# EAGLE design motor_control (EAGLE 9.6.2)
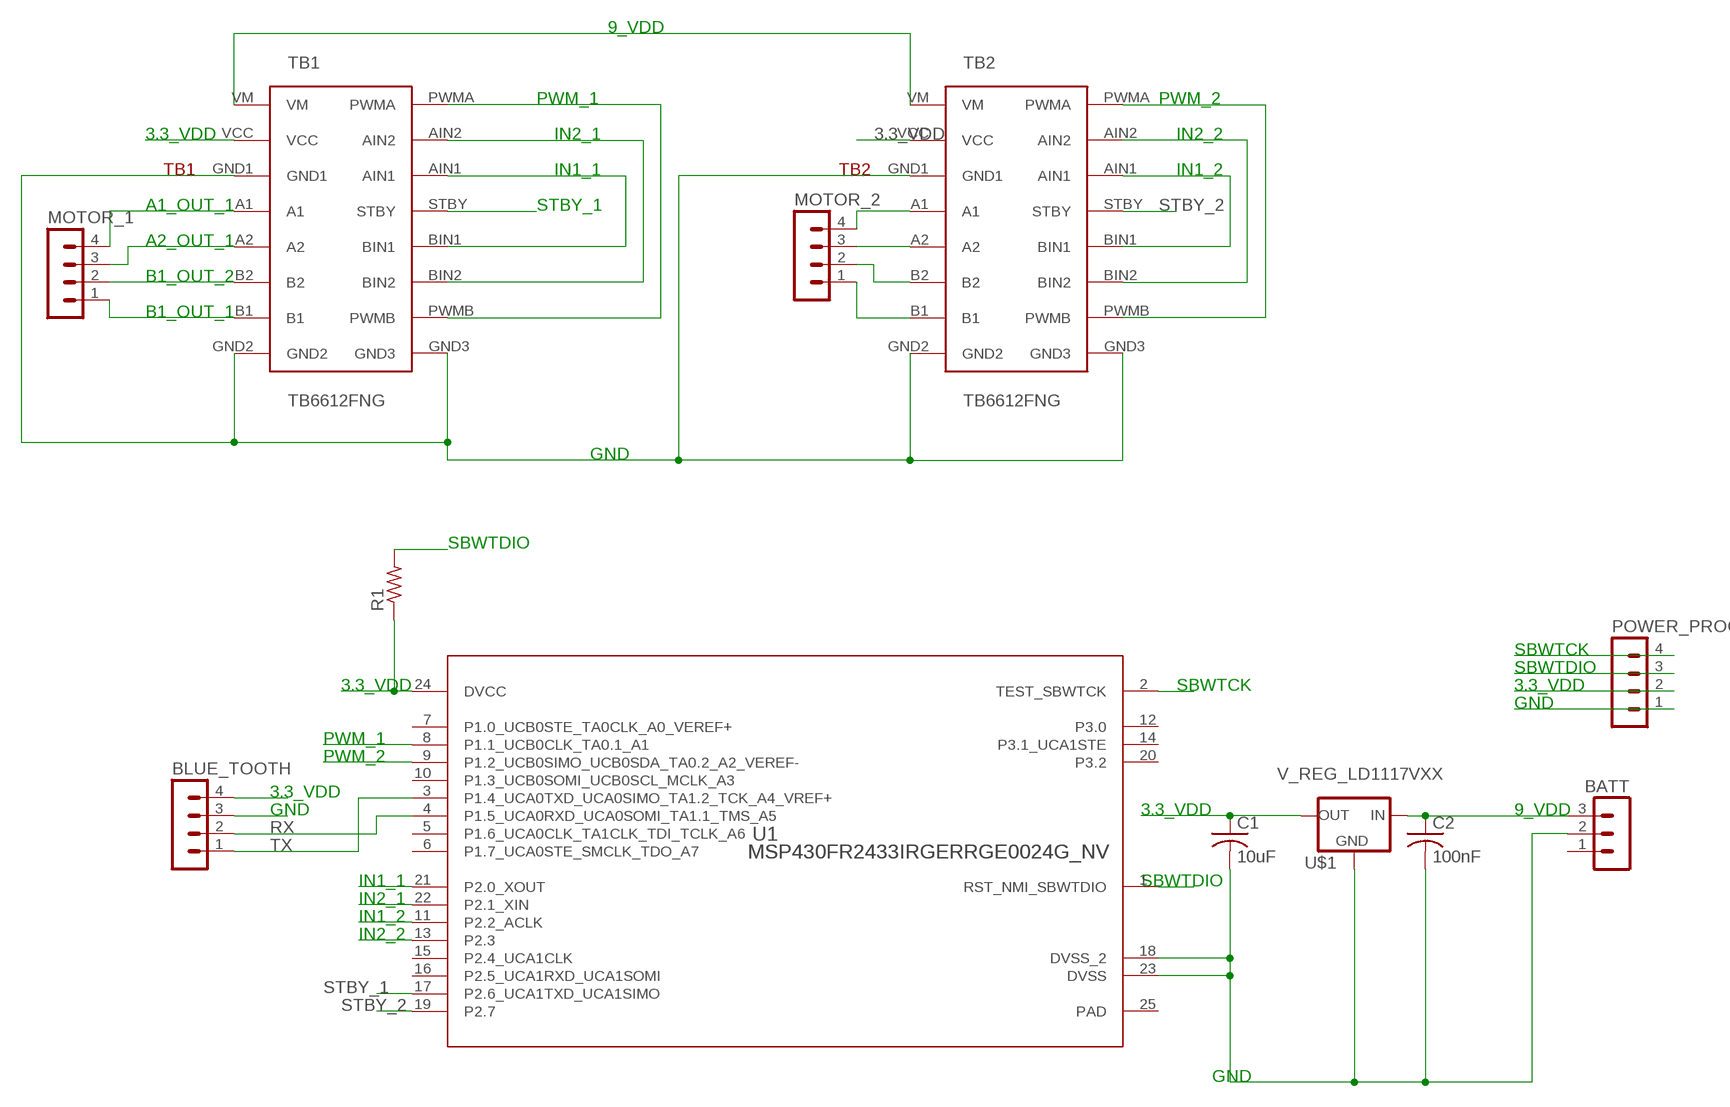
[diagram p0: schematic, sheet 1]

## Parts
BATT  MA03-1  [MA03-1]
BLUE_TOOTH  MA04-1  [MA04-1]
C1  10uF  C-USC1206  [C1206]
C2  100nF  C-USC1206  [C1206]
MOTOR_1  MA04-1  [MA04-1]
MOTOR_2  MA04-1  [MA04-1]
POWER_PROG  MA04-1  [MA04-1]
R1  R-US_R1206  [R1206]
TB1  TB6612FNG  [TB6612FNG]
TB2  TB6612FNG  [TB6612FNG]
U1  MSP430FR2433IRGERRGE0024G_NV  [RGE0024G_NV]
U$1  V_REG_LD1117VXX  [78XXL]

## Nets
3.3_VDD: BLUE_TOOTH.4 C1.1 POWER_PROG.2 R1.1 TB1.VCC TB2.VCC U1.24(DVCC) U$1.GND(OUT)
9_VDD: BATT.3 C2.1 TB1.VM TB2.VM U$1.OUT(IN)
A1_OUT_1: MOTOR_1.4 TB1.A1
A2_OUT_1: MOTOR_1.3 TB1.A2
B1_OUT_1: MOTOR_1.1 TB1.B1
B1_OUT_2: MOTOR_1.2 TB1.B2
GND: BATT.2 BLUE_TOOTH.3 C1.2 C2.2 POWER_PROG.1 TB1.GND1 TB1.GND2 TB1.GND3 TB2.GND1 TB2.GND2 TB2.GND3 U1.18(DVSS_2) U1.23(DVSS) U$1.IN(GND)
IN1_1: TB1.AIN1 TB1.BIN1 U1.21(P2.0_XOUT)
IN1_2: TB2.AIN1 TB2.BIN1 U1.11(P2.2_ACLK)
IN2_1: TB1.AIN2 TB1.BIN2 U1.22(P2.1_XIN)
IN2_2: TB2.AIN2 TB2.BIN2 U1.13(P2.3)
N$3: MOTOR_2.4 TB2.A1
N$4: MOTOR_2.3 TB2.A2
N$5: MOTOR_2.2 TB2.B2
N$6: MOTOR_2.1 TB2.B1
PWM_1: TB1.PWMA TB1.PWMB U1.8(P1.1_UCB0CLK_TA0.1_A1)
PWM_2: TB2.PWMA TB2.PWMB U1.9(P1.2_UCB0SIMO_UCB0SDA_TA0.2_A2_VEREF-)
RX: BLUE_TOOTH.2 U1.4(P1.5_UCA0RXD_UCA0SOMI_TA1.1_TMS_A5)
SBWTCK: POWER_PROG.4 U1.2(TEST_SBWTCK)
SBWTDIO: POWER_PROG.3 R1.2 U1.1(RST_NMI_SBWTDIO)
STBY_1: TB1.STBY U1.17(P2.6_UCA1TXD_UCA1SIMO)
STBY_2: TB2.STBY U1.19(P2.7)
TX: BLUE_TOOTH.1 U1.3(P1.4_UCA0TXD_UCA0SIMO_TA1.2_TCK_A4_VREF+)
Unconnected: BATT.1 U1.5(P1.6_UCA0CLK_TA1CLK_TDI_TCLK_A6) U1.6(P1.7_UCA0STE_SMCLK_TDO_A7) U1.7(P1.0_UCB0STE_TA0CLK_A0_VEREF+) U1.10(P1.3_UCB0SOMI_UCB0SCL_MCLK_A3) U1.12(P3.0) U1.14(P3.1_UCA1STE) U1.15(P2.4_UCA1CLK) U1.16(P2.5_UCA1RXD_UCA1SOMI) U1.20(P3.2)

## Power pins joined to a net without a drawn wire
PAD: U1.25(PAD)

## Library data of the parts
BATT = con-lstb:MA03-1: PIN HEADER; OC_FARNELL: unknown; OC_NEWARK: unknown
BLUE_TOOTH MOTOR_1 MOTOR_2 POWER_PROG = con-lstb:MA04-1: PIN HEADER; OC_FARNELL: unknown; OC_NEWARK: unknown
C1 C2 = rcl:C-US: CAPACITOR, American symbol; SPICEPREFIX: C
R1 = rcl:R-US_: RESISTOR, American symbol; SPICEPREFIX: R
TB1 TB2 = TB6612FNG:TB6612FNG
U1 = Texas Instruments - MSP430FR2433IRGET:MSP430FR2433IRGER; COPYRIGHT: Copyright (C) 2023 Ultra Librarian. All rights reserved.; MANUFACTURER_PART_NUMBER: MSP430FR2433IRGER; MFR_NAME: Texas Instruments; REFDES: RefDes; TYPE: TYPE
U$1 = 1X08_OFFSET_75_PERCENT:V_REG_LD1117VXX: LD1117VXX voltage regulator. We carry the 3.3V version (COM-00526) in TO-220 package.

## Board
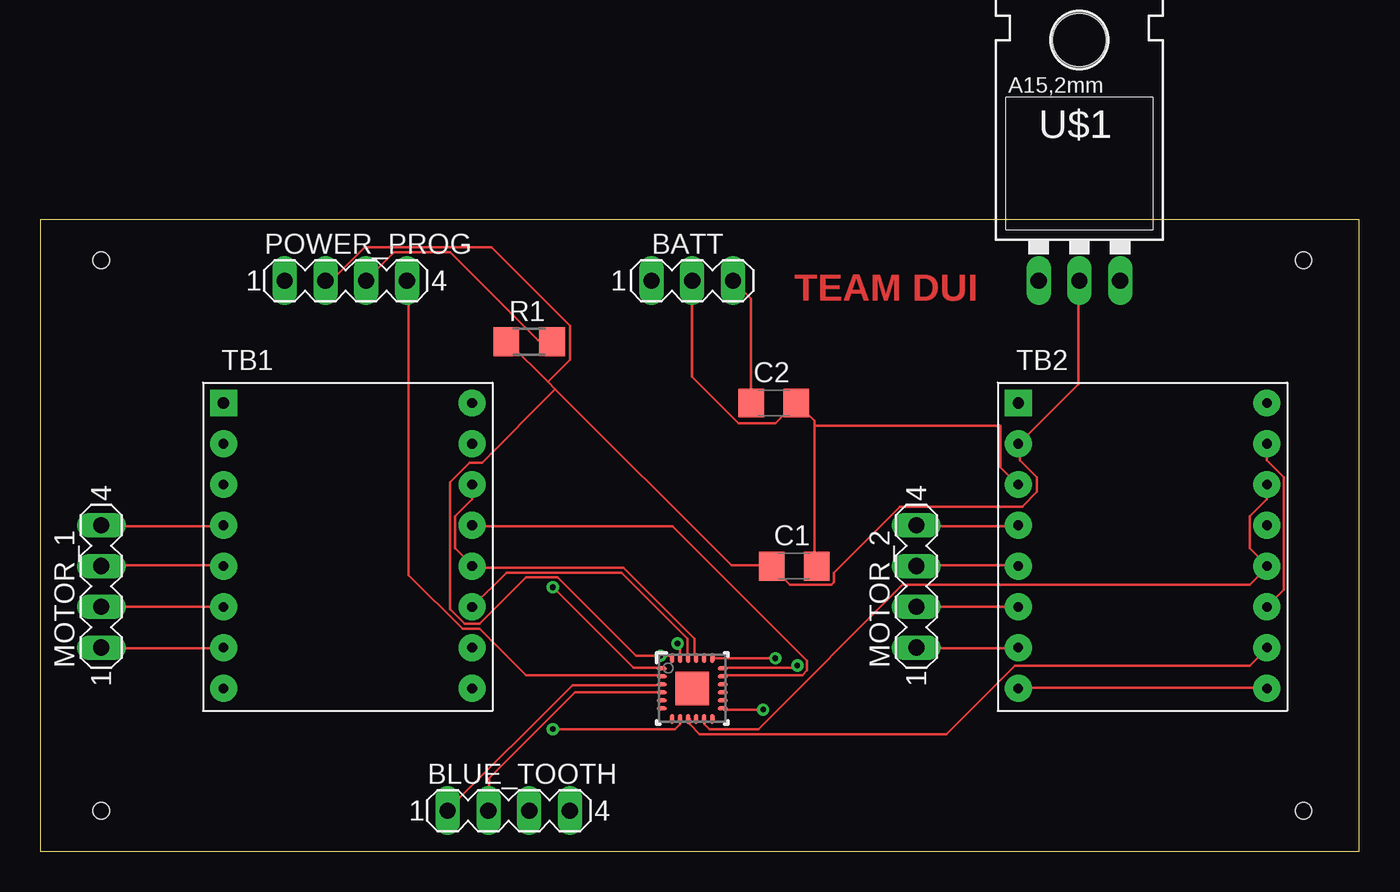
[diagram p1: board, top side]
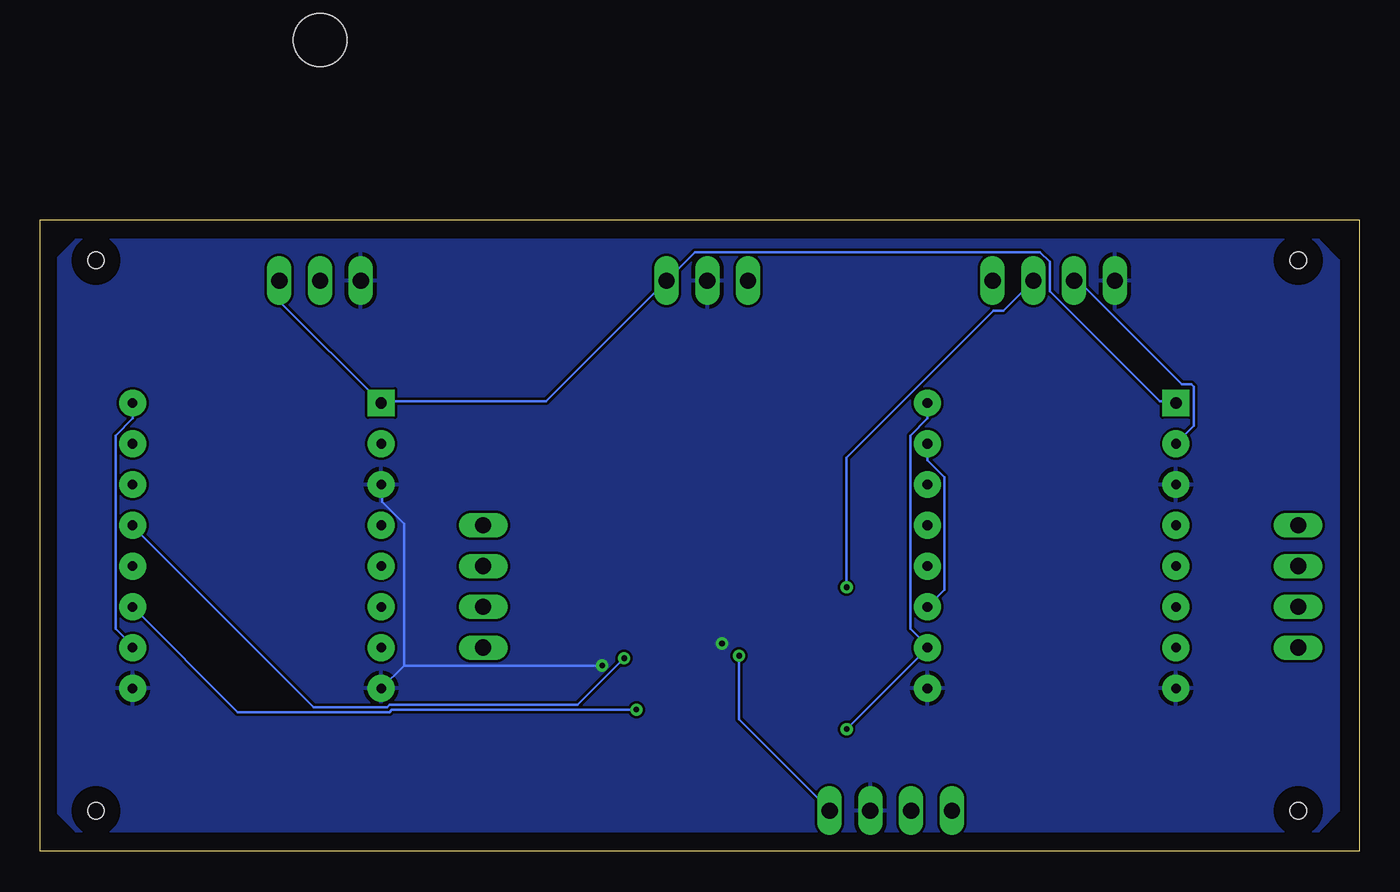
[diagram p2: board, bottom side, seen from below]

Size 82.22 x 39.36 mm. Coordinates in mm from the lower left corner, seen from the top.
Outline: 0,0 82.22,0 82.22,39.36 0,39.36 0,0
Copper layers (1*16): Top 0.035mm / dielectric 1.5mm / Bottom 0.035mm
Design rules "default": minimum track width 6mil, minimum drill 0.35mm, track to track 6mil, track to pad 6mil, pad to pad 6mil, via to via 6mil, smd to smd 6mil, copper to edge 40mil, drill to drill 6mil, minimum pad ring 10mil, minimum via ring 8mil, stop-mask expansion 4mil, vias tented up to drill 0mil, thermal gap 10mil
Holes 1 mm at 3.81,36.83 78.74,2.54 78.74,36.83 3.81,2.54

### Footprints (pad centres in the part's own frame; a part is rotated, then mirrored left to right if it is on the bottom)
MA03-1 = drill 1.016 long: 1 -2.54,0; 2 0,0; 3 2.54,0
MA04-1 = drill 1.016 long: 1 -3.81,0; 2 -1.27,0; 3 1.27,0; 4 3.81,0
C1206 = smd 1.6 x 1.8: 1 -1.4,0; 2 1.4,0
R1206 = smd 1.6 x 1.803: 1 -1.422,0; 2 1.422,0
TB6612FNG = drill 0.6 pad 1.676: A1 -7.62,-1.27; A2 -7.62,-3.81; AIN1 7.874,1.27; AIN2 7.874,3.81; B1 -7.62,-8.89; B2 -7.62,-6.35; BIN1 7.874,-3.81; BIN2 7.874,-6.35; GND1 -7.62,1.27; GND2 -7.62,-11.43; GND3 7.874,-11.43; PWMA 7.874,6.35; PWMB 7.874,-8.89; STBY 7.874,-1.27; VCC -7.62,3.81 | drill 0.7 pad 1.676 square: VM -7.62,6.35
RGE0024G_NV = smd 0.6 x 0.24: 1 -1.9,1.25; 2 -1.9,0.75; 3 -1.9,0.25; 4 -1.9,-0.25; 5 -1.9,-0.75; 6 -1.9,-1.25; 13 1.9,-1.25; 14 1.9,-0.75; 15 1.9,-0.25; 16 1.9,0.25; 17 1.9,0.75; 18 1.9,1.25 | smd 0.24 x 0.6: 7 -1.25,-1.9; 8 -0.75,-1.9; 9 -0.25,-1.9; 10 0.25,-1.9; 11 0.75,-1.9; 12 1.25,-1.9; 19 1.25,1.9; 20 0.75,1.9; 21 0.25,1.9; 22 -0.25,1.9; 23 -0.75,1.9; 24 -1.25,1.9 | smd 2.1 x 2.1: 25 0,0
78XXL = drill 1.016 long: GND 0,-3.81; IN -2.54,-3.81; OUT 2.54,-3.81 | hole 3.302: 0,11.176

### Placement (x,y rotation side)
BATT  40.64,35.56 0 top
BLUE_TOOTH  29.21,2.54 0 top
C1  46.99,17.78 0 top
C2  45.72,27.94 0 top
MOTOR_1  3.81,16.51 90 top
MOTOR_2  54.61,16.51 90 top
POWER_PROG  19.05,35.56 0 top
R1  30.48,31.75 0 top
TB1  19.05,21.59 0 top
TB2  68.58,21.59 0 top
U1  40.64,10.16 0 top
U$1  64.77,39.37 0 top

### Tracks (layer width: path | path; a pad name or v marks a point on that pad's centre or on a via)
3.3_VDD  (via drill 0.35)
  Top 0.152: U$1.GND 64.72,35.51 64.72,29.11 61.06,25.45 TB2.VCC 61.06,25.3 61.06,24.38 62.13,23.32 62.13,22.4 61.21,21.49 53.59,21.49 49.48,17.37 49.48,16.76 49.33,16.61 46.74,16.61 45.67,17.68 C1.1 45.52,17.83 43.08,17.83 32.11,28.8 | U1.24 39.42,12.19 v38.66,12.19 37.14,12.19 32.26,17.07 30.28,17.07 27.38,14.17 26.47,14.17 25.55,15.09 25.55,23.01 26.77,24.23 27.53,24.23 32.11,28.8 | 31.65,29.26 29.21,31.7 R1.1 | 31.65,29.26 32.11,28.8 | 31.65,29.26 33.02,30.63 33.02,32.77 28.14,37.64 20.22,37.64 18.24,35.66 17.78,35.66 POWER_PROG.2
  Bottom 0.152: TB1.VCC 10.31,26.52 10.31,28.96 10.46,29.11 11.07,29.11 17.48,35.51 17.78,35.51 POWER_PROG.2 | v38.66,12.19 38.66,8.23 33.02,2.59 BLUE_TOOTH.4
9_VDD
  Top 0.152: BATT.3 44.3,34.44 44.3,28.04 C2.1
  Bottom 0.152: U$1.OUT 67.31,34.29 TB2.VM 60.91,28.04 50.7,28.04 BATT.3 41.4,37.34 19.91,37.34 19.3,36.73 19.3,34.9 12.45,28.04 11.53,28.04 TB1.VM
A1_OUT_1
  Top 0.152: MOTOR_1.4 3.91,20.27 11.38,20.27 TB1.A1
A2_OUT_1
  Top 0.152: MOTOR_1.3 3.91,17.83 11.38,17.83 TB1.A2
B1_OUT_1
  Top 0.152: MOTOR_1.1 3.91,12.65 11.38,12.65 TB1.B1
B1_OUT_2
  Top 0.152: TB1.B2 MOTOR_1.2
GND  (via drill 0.35)
  Top 0.152: 62.13,35.51 U$1.IN | TB2.GND1 60.91,22.86 59.84,23.93 59.84,26.52 48.26,26.52 | 48.26,26.52 48.26,26.82 47.19,27.89 C2.2 47.04,27.89 45.82,26.67 43.54,26.67 40.64,29.57 BATT.2 | 48.26,26.52 48.26,17.83 C1.2 | 11.53,10.21 TB1.GND2 | 11.53,22.86 TB1.GND1 | v47.19,11.58 47.04,11.43 42.62,11.43 U1.18 | v39.73,12.95 39.88,12.8 39.88,12.19 U1.23 | TB2.GND3 76.45,10.21 61.06,10.21 TB2.GND2
  Bottom 0.152: 26.92,10.06 TB1.GND3 | 59.54,11.58 v47.19,11.58 | TB2.GND2 59.54,11.58 | 11.53,10.21 TB1.GND2 | 59.54,11.58 59.54,20.42 60.91,21.79 60.91,22.86 TB2.GND1
  pour Bottom: 8.89,38.1 2.54,38.1 1.27,36.83 1.27,2.54 2.54,1.27 80.01,1.27 81.28,2.54 81.28,36.83 80.01,38.1
IN1_1
  Top 0.152: U1.21 40.79,12.19 40.79,13.26 36.37,17.68 26.92,17.68 TB1.BIN1 26.92,17.83 25.86,18.9 25.86,20.88 26.92,21.95 TB1.AIN1
IN1_2
  Top 0.152: U1.11 41.4,8.23 41.4,7.92 41.71,7.62 44.75,7.62 53.75,16.61 75.39,16.61 76.45,17.68 TB2.BIN1 76.45,17.83 75.39,18.9 75.39,20.88 76.45,21.95 TB2.AIN1
IN2_1
  Top 0.152: TB1.BIN2 29.06,17.37 36.22,17.37 40.33,13.26 40.33,12.19 U1.22
  Bottom 0.152: TB1.AIN2 26.92,24.38 25.86,23.32 25.86,16.31 TB1.BIN2
IN2_2  (via drill 0.35)
  Top 0.152: v45.06,8.84 42.62,8.84 U1.13 | TB2.AIN2 76.45,24.38 77.52,23.32 77.52,16.31 TB2.BIN2
  Bottom 0.152: v45.06,8.84 60.3,8.84 60.45,8.69 69.9,8.69 TB2.BIN2
N$3
  Top 0.152: MOTOR_2.4 54.66,20.27 60.91,20.27 TB2.A1
N$4
  Top 0.152: MOTOR_2.3 54.66,17.83 60.91,17.83 TB2.A2
N$5
  Top 0.152: TB2.B2 MOTOR_2.2
N$6
  Top 0.152: MOTOR_2.1 54.66,12.65 60.91,12.65 TB2.B1
PWM_1  (via drill 0.35)
  Top 0.152: v31.95,7.62 39.57,7.62 39.88,7.92 39.88,8.23 U1.8
  Bottom 0.152: v31.95,7.62 26.92,12.65 TB1.PWMB 26.92,12.8 27.99,13.87 27.99,25.91 26.92,26.98 TB1.PWMA
PWM_2
  Top 0.152: U1.9 40.49,8.23 40.49,7.92 41.1,7.31 56.49,7.31 60.76,11.58 75.39,11.58 76.45,12.65 TB2.PWMB
  Bottom 0.152: TB2.PWMA 76.45,26.98 77.52,25.91 77.52,13.87 76.45,12.8 TB2.PWMB
RX
  Top 0.152: U1.4 38.66,9.91 33.33,9.91 27.99,4.57 27.99,2.59 BLUE_TOOTH.2
SBWTCK
  Top 0.152: U1.2 38.66,10.97 30.28,10.97 27.38,13.87 26.31,13.87 22.96,17.22 22.96,35.51 POWER_PROG.4
SBWTDIO  (via drill 0.35)
  Top 0.152: v31.95,16.46 36.98,11.43 38.66,11.43 U1.1 | R1.2 31.8,31.85 31.04,31.85 25.55,37.34 22.05,37.34 20.37,35.66 POWER_PROG.3
  Bottom 0.152: v31.95,16.46 31.95,24.54 22.81,33.68 22.2,33.68 POWER_PROG.3
STBY_1
  Top 0.152: U1.17 42.62,10.97 47.5,10.97 47.8,11.28 47.8,11.89 39.42,20.27 26.92,20.27 TB1.STBY
STBY_2  (via drill 0.35)
  Top 0.152: v45.82,12.04 41.86,12.04 U1.19
  Bottom 0.152: v45.82,12.04 48.72,9.14 60.45,9.14 60.6,8.99 65.18,8.99 76.45,20.27 TB2.STBY
TX
  Top 0.152: U1.3 38.66,10.36 33.17,10.36 25.4,2.59 BLUE_TOOTH.1

### Text on the board
Top: TEAM DUI